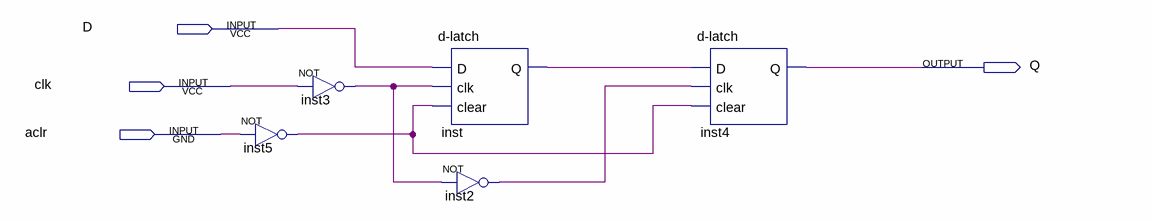
[diagram p0: schematic sheet]
// Quartus schematic d-ff.bdf as structural Verilog: 5 symbols, 4 pins
module \d-ff  (
  input  D,
  input  clk,
  input  aclr,
  output Q
);

  wire inst2_out, inst3_out, inst5_out, inst_q;

  not inst5 (inst5_out, aclr);
  not inst3 (inst3_out, clk);
  \d-latch  inst (.D(D), .clk(inst3_out), .clear(inst5_out), .Q(inst_q));
  not inst2 (inst2_out, inst3_out);
  \d-latch  inst4 (.D(inst_q), .clk(inst2_out), .clear(inst5_out), .Q(Q));
endmodule
